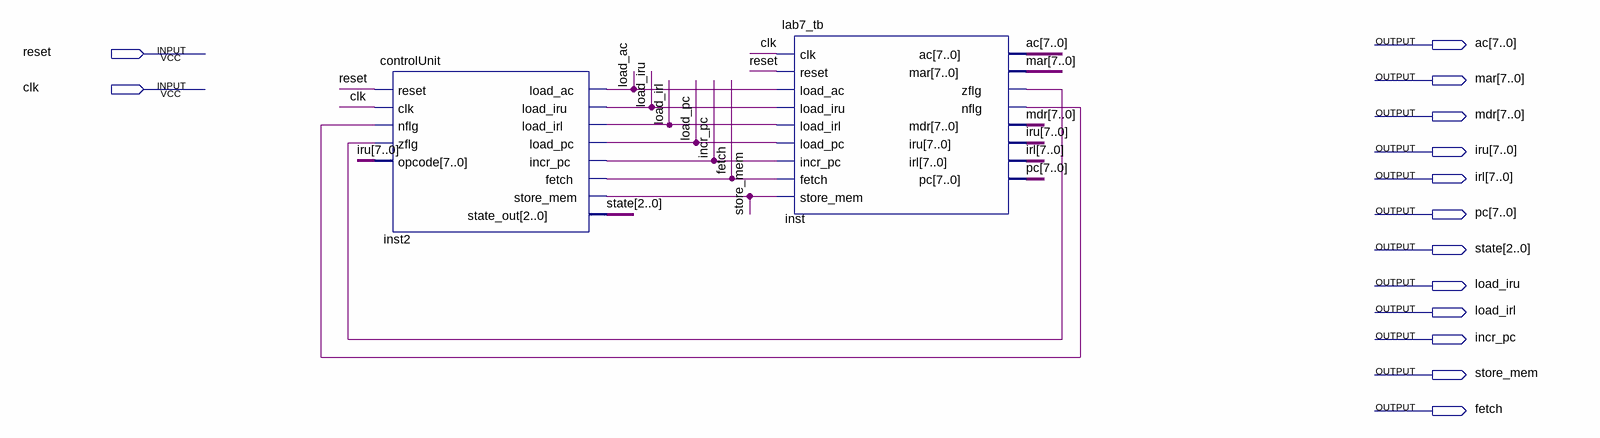
[diagram p0: schematic sheet]
// Quartus schematic controlUnit_tb.bdf as structural Verilog: 2 symbols, 14 pins
module controlUnit_tb (
  input  reset,
  input  clk,
  output [7:0] ac,
  output [7:0] mar,
  output [7:0] mdr,
  output [7:0] iru,
  output [7:0] irl,
  output [7:0] pc,
  output [2:0] state,
  output load_iru,
  output load_irl,
  output incr_pc,
  output store_mem,
  output fetch
);

  wire inst_nflg, inst_zflg, load_ac, load_pc;

  controlUnit inst2 (
    .reset(reset), .clk(clk), .nflg(inst_nflg), .zflg(inst_zflg), .opcode(iru), .load_ac(load_ac),
    .load_iru(load_iru), .load_irl(load_irl), .load_pc(load_pc), .incr_pc(incr_pc), .fetch(fetch),
    .store_mem(store_mem), .state_out(state));
  lab7_tb inst (
    .clk(clk), .reset(reset), .load_ac(load_ac), .load_iru(load_iru), .load_irl(load_irl), .load_pc(load_pc),
    .incr_pc(incr_pc), .fetch(fetch), .store_mem(store_mem), .ac(ac), .mar(mar), .zflg(inst_zflg),
    .nflg(inst_nflg), .mdr(mdr), .iru(iru), .irl(irl), .pc(pc));
endmodule
